# EAGLE design akabeacon_monster (EAGLE 7.2.0)
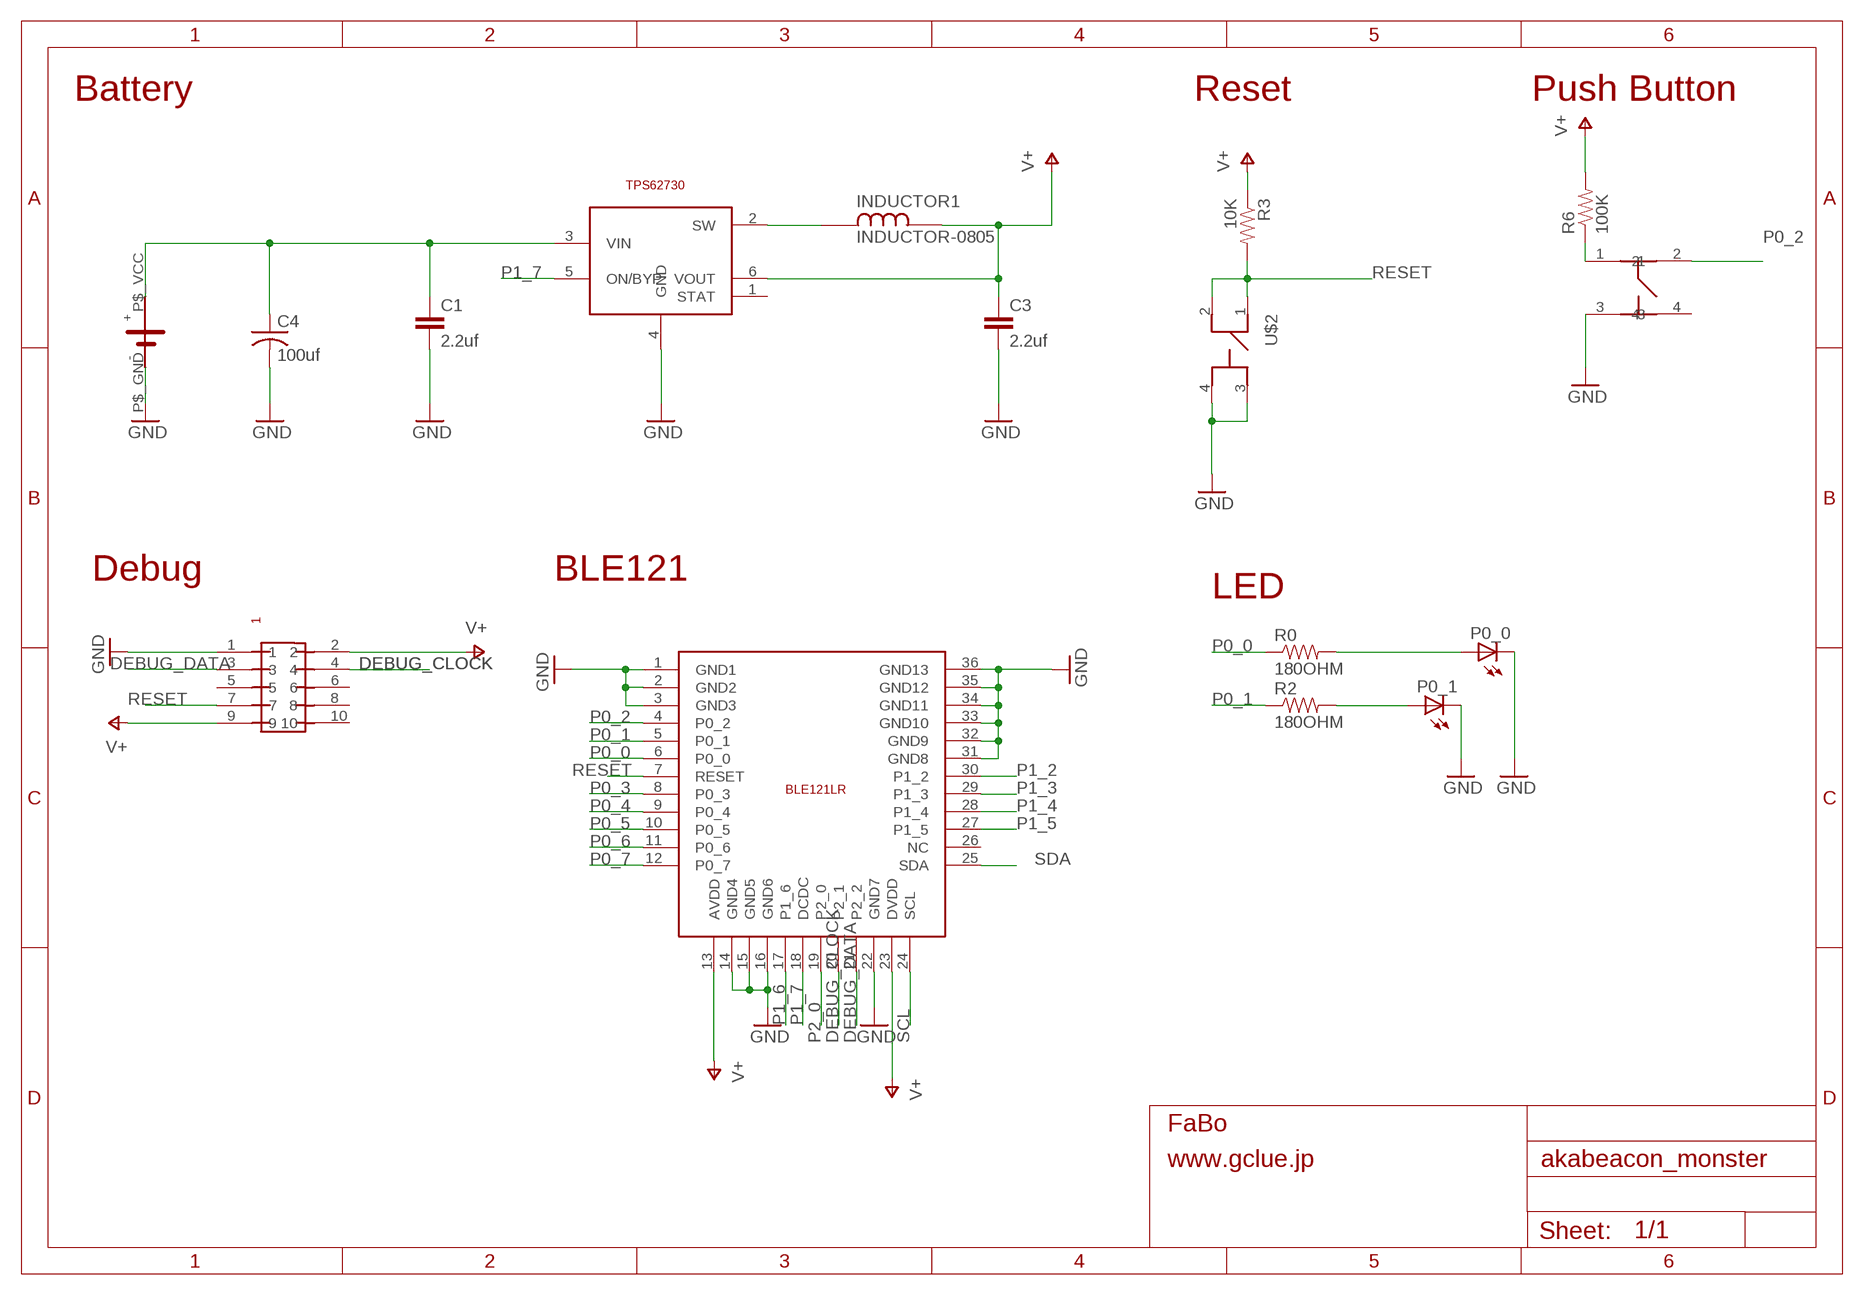
[diagram p0: schematic, sheet 1]

## Parts
BLE1  BLUEGIGA-BLE121LR  [BLUEGIGA-BLE121LR]
C1  2.2uf  C-EUC0603  [C0603]
C3  2.2uf  C-EUC0603  [C0603]
C4  100uf  C-USC3225  [C3225]
INDUCTOR1  INDUCTOR-0805  [INDUCTOR-0805]
P0_0  LEDCHIP-LED0603  [CHIP-LED0603]
P0_1  LEDCHIP-LED0603  [CHIP-LED0603]
R0  180OHM  RESISTOR0603-RES  [0603-RES]
R2  180OHM  RESISTOR0603-RES  [0603-RES]
R3  10K  RESISTOR0603-RES  [0603-RES]
R6  100K  RESISTOR0603-RES  [0603-RES]
TPS1  TI-TPS62730  [TI-TPS62730]
U$1  SMTU2450-BOTTOM-MINI  [SMTU2450-BOTTOM-MINI]
U$2  SWITCH-LS6J2M-T  [SWITCH-LS6J2M-T]
U$3  PIN-HEADER-SMT(1.27MM)2X5  [PIN-HEADER-SMT(1.27MM)2X5]
U$5  SWICTH-4P(KMR2)  [SWITCH-4P(KMR2)]

## Nets
DEBUG_CLOCK: BLE1.20(P2_1) U$3.4
DEBUG_DATA: BLE1.21(P2_2) U$3.3
GND: BLE1.1(GND1) BLE1.2(GND2) BLE1.3(GND3) BLE1.22(GND7) BLE1.31(GND8) BLE1.32(GND9) BLE1.33(GND10) BLE1.34(GND11) BLE1.35(GND12) BLE1.36(GND13) C1.2 C3.2 C4.2 P0_0.C P0_1.C TPS1.4(GND) U$1.P$_GND U$2.3 U$2.4 U$3.1 U$5.3
N$1: C1.1 C4.1 TPS1.3(VIN) U$1.P$_VCC
N$2: P0_0.A R0.2
N$3: P0_1.A R2.2
N$4: U$5.2
N$5: INDUCTOR1.P$1 TPS1.2(SW)
N$8: BLE1.14(GND4) BLE1.15(GND5) BLE1.16(GND6) ; supply symbol labelled GND
P0_0: BLE1.6(P0_0) R0.1
P0_1: BLE1.5(P0_1) R2.1
P0_2: BLE1.4(P0_2) R6.1 U$5.1
P0_3: BLE1.8(P0_3)
P0_4: BLE1.9(P0_4)
P0_5: BLE1.10(P0_5)
P0_6: BLE1.11(P0_6)
P0_7: BLE1.12(P0_7)
P1_2: BLE1.30(P1_2)
P1_3: BLE1.29(P1_3)
P1_4: BLE1.28(P1_4)
P1_5: BLE1.27(P1_5)
P1_6: BLE1.17(P1_6)
P1_7: BLE1.18(DCDC) TPS1.5(ON/BYP)
P2_0: BLE1.19(P2_0)
RESET: BLE1.7(RESET) R3.2 U$2.1 U$2.2 U$3.7
SCL: BLE1.24(SCL)
SDA: BLE1.25(SDA)
V+: BLE1.13(AVDD) BLE1.23(DVDD) C3.1 INDUCTOR1.P$2 R3.1 R6.2 TPS1.6(VOUT) U$3.2 U$3.9
Unconnected: BLE1.26(NC) TPS1.1(STAT) U$3.5 U$3.6 U$3.8 U$3.10 U$5.4

## Notes on the sheet
- Battery | Reset | Push Button
- Debug | BLE121
- LED

## Library data of the parts
BLE1 = gclueBT:BLUEGIGA-BLE121LR: Bluetooth Bluetooth 4.0 low energy radio Radio Transmit power: +8 dBm Receiver sensitivity: -98 dBm Typical line-of-sight range: up to 450 meters Current Consumption TX peak current: 36 mA, 25 mA (with DC/DC) RX peak current: 33 mA Power mode 1: 2.7 mA Power mode 2: 1.3 uA Power mode 3: 0.5 uA Certifications Japan: MIC Japan certification ( 209-J00111 )
C1 C3 = rcl:C-EU: CAPACITOR, European symbol
C4 = rcl:C-US: CAPACITOR, American symbol
INDUCTOR1 = gclueParts:INDUCTOR-0805
P0_0 P0_1 = led:LED: LED OSRAM: - CHIPLED LG R971, LG N971, LY N971, LG Q971, LY Q971, LO R971, LY R971 LH N974, LH R974 LS Q976, LO Q976, LY Q976 LO Q996 - Hyper CHIPLED LW Q18S LB Q993, LB Q99A, LB R99A - SideLED LS A670, LO A670, LY A670, LG A670, LP A670 LB A673, LV A673, LT A673, LW A673 LH A674 LY A675 LS A676, LA A676, LO A676, LY A676, LW A676 LS A679, LY A679, LG A679 - Hyper Micro SIDELED® LS Y876, LA Y876, LO Y876, LY Y876 LT Y87S - SmartLED LW L88C, LW L88S LB L89C, LB L89S, LG L890 LS L89K, LO L89K, LY L89K LS L896, LA L896, LO L896, LY L896 - TOPLED LS T670, LO T670, LY T670, LG T670, LP T670 LSG T670, LSP T670, LSY T670, LOP T670, LYG T670 LG T671, LOG T671, LSG T671 LB T673, LV T673, LT T673, LW T673 LH T674 LS T676, LA T676, LO T676, LY T676, LB T676, LH T676, LSB T676, LW T676 LB T67C, LV T67C, LT T67C, LS T67K, LO T67K, LY T67K, LW E67C LS E67B, LA E67B, LO E67B, LY E67B, LB E67C, LV E67C, LT E67C LW T67C LS T679, LY T679, LG T679 LS T770, LO T770, LY T770, LG T770, LP T770 LB T773, LV T773, LT T773, LW T773 LH T774 LS E675, LA E675, LY E675, LS T675 LS T776, LA T776, LO T776, LY T776, LB T776 LHGB T686 LT T68C, LB T68C - Hyper Mini TOPLED® LB M676 - Mini TOPLED Santana® LG M470 LS M47K, LO M47K, LY M47K Source: http://www.osram.convergy.de LUXEON: - LUMILED® LXK2-PW12-R00, LXK2-PW12-S00, LXK2-PW14-U00, LXK2-PW14-V00 LXK2-PM12-R00, LXK2-PM12-S00, LXK2-PM14-U00 LXK2-PE12-Q00, LXK2-PE12-R00, LXK2-PE12-S00, LXK2-PE14-T00, LXK2-PE14-U00 LXK2-PB12-K00, LXK2-PB12-L00, LXK2-PB12-M00, LXK2-PB14-N00, LXK2-PB14-P00, LXK2-PB14-Q00 LXK2-PR12-L00, LXK2-PR12-M00, LXK2-PR14-Q00, LXK2-PR14-R00 LXK2-PD12-Q00, LXK2-PD12-R00, LXK2-PD12-S00 LXK2-PH12-R00, LXK2-PH12-S00 LXK2-PL12-P00, LXK2-PL12-Q00, LXK2-PL12-R00 Source: www.luxeon.com KINGBRIGHT: KA-3528ASYC Source: www.kingbright.com
R0 R2 R3 R6 = SparkFun:RESISTOR: Resistor Basic schematic elements and footprints for 0603, 1206, and PTH resistors.
TPS1 = gclueSupply:TI-TPS62730
U$1 = gclue:SMTU2450-BOTTOM-MINI
U$2 = gclue:SWITCH-LS6J2M-T: Switch Tact SMD(LS6J2M-T)
U$3 = gclue-test:PIN-HEADER-SMT(1.27MM)2X5: PIN-HEADER-SMT (1.27MM) 2x5
U$5 = gclue-test:SWICTH-4P(KMR2)

## Board
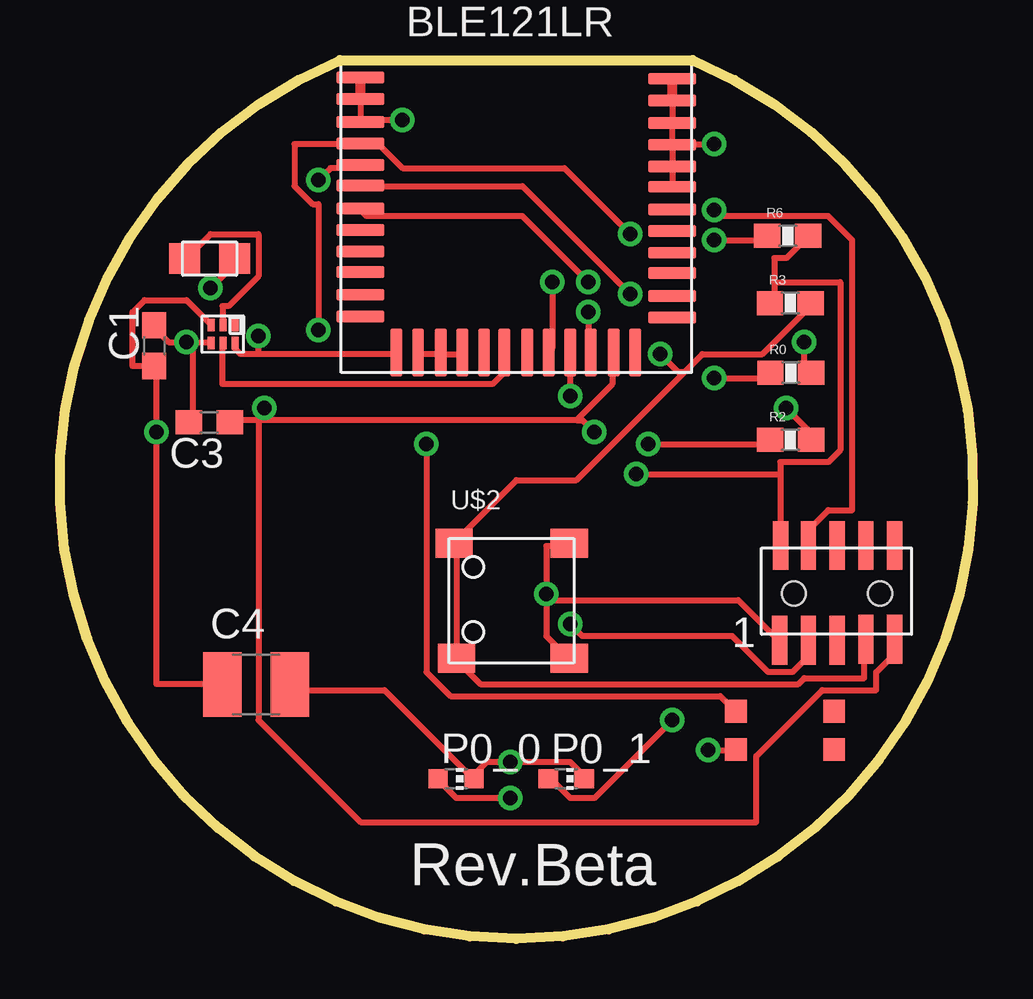
[diagram p1: board, top side]
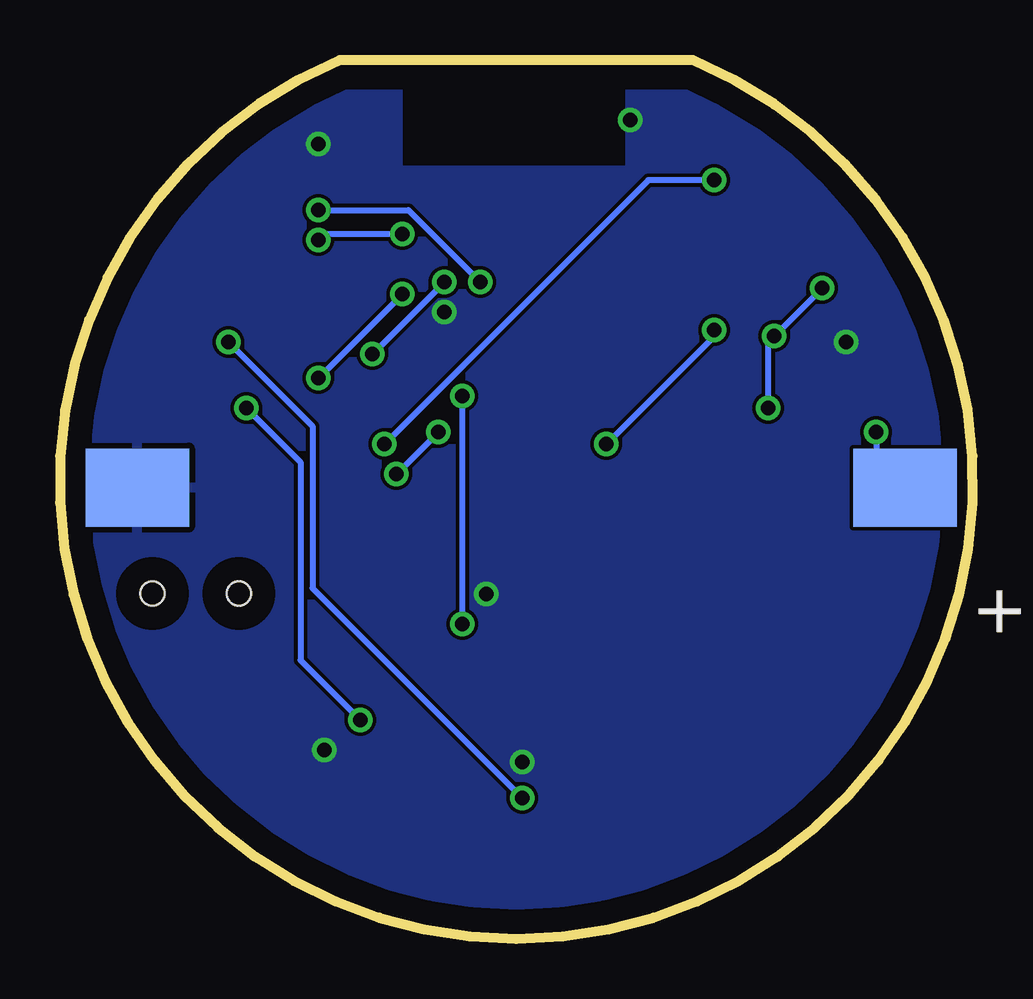
[diagram p2: board, bottom side, seen from below]

Size 38.05 x 36.61 mm. Coordinates in mm from the lower left corner, seen from the top.
Outline: 26.38,36.61 arc-315 11.68,36.61 26.38,36.61
Copper layers (1*16): Top 0.035mm / dielectric 1.5mm / Bottom 0.035mm
Design rules "default *": minimum track width 10mil, minimum drill 24mil, track to track 6mil, track to pad 6mil, pad to pad 6mil, via to via 6mil, smd to smd 6mil, copper to edge 40mil, drill to drill 8mil, minimum pad ring 10mil, minimum via ring 8mil, stop-mask expansion 4mil, vias tented up to drill 0mil, thermal gap 10mil
tRestrict: area 15,32.4 to 23.5,38.6
bRestrict: area 15,32.4 to 23.5,38.7

### Footprints (pad centres in the part's own frame; a part is rotated, then mirrored left to right if it is on the bottom)
BLUEGIGA-BLE121LR = smd 2 x 0.5: 1 -6.4,4.8; 2 -6.4,3.9; 3 -6.4,2.95; 4 -6.4,2.05; 5 -6.4,1.15; 6 -6.4,0.3; 7 -6.4,-0.65; 8 -6.4,-1.55; 9 -6.4,-2.45; 10 -6.4,-3.3; 11 -6.4,-4.25; 12 -6.4,-5.15; 25 6.6,-5.2; 26 6.6,-4.3; 27 6.6,-3.35; 28 6.6,-2.5; 29 6.6,-1.6; 30 6.6,-0.7; 31 6.6,0.25; 32 6.6,1.1; 33 6.6,2; 34 6.6,2.9; 35 6.6,3.85; 36 6.6,4.75 | smd 0.5 x 2: 13 -4.9,-6.65; 14 -4,-6.65; 15 -3.05,-6.65; 16 -2.15,-6.65; 17 -1.25,-6.65; 18 -0.4,-6.65; 19 0.55,-6.65; 20 1.45,-6.65; 21 2.35,-6.65; 22 3.2,-6.65; 23 4.15,-6.65; 24 5.05,-6.65
C0603 = smd 1.1 x 1: 1 -0.85,0; 2 0.85,0
C3225 = smd 1.6 x 2.7: 1 -1.4,0; 2 1.4,0
INDUCTOR-0805 = smd 1.3 x 1.27: P$1 -1.04,0.02; P$2 1.04,0.01
CHIP-LED0603 = smd 0.8 x 0.8: A 0,-0.75; C 0,0.75
0603-RES = smd 1.1 x 1: 1 -0.85,0; 2 0.85,0
TI-TPS62730 = smd 0.3 x 0.52: 1 0.48,0.25; 2 -0.02,0.25; 3 -0.52,0.25; 4 -0.52,-0.5; 5 -0.02,-0.5; 6 0.48,-0.5
SMTU2450-BOTTOM-MINI = smd 3.251 x 4.318 bottom: P$_GND 0,-16; P$_VCC 0,16
SWITCH-LS6J2M-T = smd 1.55 x 1.2: 1 -2.4,2.4; 2 -2.3,-2.4; 3 2.4,2.4; 4 2.4,-2.4
PIN-HEADER-SMT(1.27MM)2X5 = smd 0.635 x 2.032: 1 -2.8,-1.65; 2 -2.75,2.3; 3 -1.6,-1.65; 4 -1.6,2.3; 5 -0.4,-1.65; 6 -0.4,2.3; 7 0.8,-1.6; 8 0.8,2.3; 9 2,-1.6; 10 2,2.3 | hole 1: 1.4,0.3; -2.2,0.3
SWITCH-4P(KMR2) = smd 0.9 x 0.95: 1 -1,0; 2 3.1,0; 3 -1,-1.6; 4 3.1,-1.6

### Placement (x,y rotation side)
BLE1  18.93,31.08 0 top
C1  3.94,24.71 90 top
C3  6.23,21.51 180 top
C4  8.18,10.59 0 top
INDUCTOR1  6.24,28.32 0 top
P0_0  16.52,6.66 270 top
P0_1  21.11,6.66 270 top
R0  30.47,23.58 0 top
R2  30.46,20.78 0 top
R3  30.45,26.48 0 top
R6  30.34,29.28 0 top
TPS1  6.83,25.32 0 top
U$1  18.83,18.79 90 top
U$2  18.83,14.08 0 top
U$3  32.8,14.08 0 top
U$5  29.18,9.48 0 top

### Tracks (layer width: path | path; a pad name or v marks a point on that pad's centre or on a via)
DEBUG_CLOCK  (via drill 0.61)
  Top 0.254: v20.53,27.36 20.53,24.61 BLE1.20 | v27.28,30.36 27.53,30.11 32.03,30.11 33.03,29.11 33.03,17.86 32.03,17.86 31.28,17.11 31.28,16.61 U$3.4
  Bottom 0.254: v20.53,27.36 23.53,30.36 v27.28,30.36
DEBUG_DATA  (via drill 0.61)
  Top 0.254: v21.28,22.61 BLE1.21 | v21.28,13.11 21.78,12.61 28.03,12.61 29.53,11.11 30.53,11.11 31.03,11.61 31.03,12.36 U$3.3
  Bottom 0.254: v21.28,13.11 v21.28,22.61
GND  (via drill 0.61)
  Top 0.254: P0_1.C 21.78,6.86 21.28,7.36 v18.78,7.36 17.78,7.36 17.28,6.86 P0_0.C 17.03,6.86 13.53,10.36 9.78,10.36 C4.2 | 20.28,14.11 v20.28,14.36 20.28,16.36 21.03,16.36 U$2.3 | 20.28,14.11 20.28,12.61 21.03,11.86 U$2.4 | 20.28,14.11 28.28,14.11 29.78,12.61 U$3.1 | 5.53,24.86 v5.28,24.86 4.53,24.86 4.03,25.36 C1.2 | 5.53,24.86 6.28,24.86 TPS1.4 | 5.53,24.86 5.53,21.61 C3.2 | BLE1.2 12.53,34.11 | BLE1.35 BLE1.34 25.53,33.11 | BLE1.31 BLE1.32 BLE1.33 25.53,33.11 | v27.03,7.86 28.03,7.86 U$5.3 | 25.53,33.11 v27.28,33.11 | v22.03,26.11 22.03,24.61 BLE1.22 | v14.28,34.11 12.53,34.11 | 12.53,34.11 BLE1.3
  Top 0.406: BLE1.2 BLE1.1 | BLE1.35 BLE1.36
  pour Bottom: -1.52,0.01 38.28,0.01 38.28,38.31 23.98,38.31 23.98,32.01 14.28,32.01 14.28,38.51 -1.82,38.51
N$1  (via drill 0.61)
  Top 0.254: TPS1.3 6.28,25.61 5.28,26.61 3.53,26.61 3.03,26.11 3.03,23.86 C1.1 4.03,23.86 v4.03,21.11 4.03,10.61 6.78,10.61 C4.1
  Bottom 0.254: v4.03,21.11 4.03,19.86 3.03,18.86 U$1.P$_VCC
N$2  (via drill 0.61)
  Top 0.254: v18.78,5.86 16.53,5.86 15.78,6.61 P0_0.A | v31.03,24.86 31.03,23.61 31.28,23.61 R0.2
  Bottom 0.254: v18.78,5.86 27.53,14.61 27.53,21.36 v31.03,24.86
N$3  (via drill 0.61)
  Top 0.254: v25.53,9.11 22.28,5.86 21.28,5.86 20.53,6.61 P0_1.A | v30.28,22.11 31.53,20.86 R2.2
  Bottom 0.254: v25.53,9.11 28.03,11.61 28.03,19.86 v30.28,22.11
N$5
  Top 0.254: TPS1.2 6.78,25.61 6.78,26.36 7.03,26.36 8.28,27.61 8.28,29.36 6.28,29.36 5.28,28.36 INDUCTOR1.P$1
N$8
  Top 0.254: BLE1.14 15.03,24.36 15.78,24.36 BLE1.15 16.03,24.36 16.78,24.36 BLE1.16
P0_0  (via drill 0.61)
  Top 0.254: v27.28,23.36 29.53,23.36 R0.1 | v23.78,26.86 19.28,31.36 12.53,31.36 BLE1.6
  Bottom 0.254: v23.78,26.86 v27.28,23.36
P0_1  (via drill 0.61)
  Top 0.254: v24.53,20.61 29.53,20.61 R2.1 | v10.78,31.61 11.28,32.11 12.53,32.11 BLE1.5
  Bottom 0.254: v24.53,20.61 13.53,31.61 v10.78,31.61
P0_2  (via drill 0.61)
  Top 0.254: v15.28,20.61 15.28,11.11 16.28,10.11 27.53,10.11 28.03,9.61 U$5.1 | v10.78,25.36 10.78,30.61 10.53,30.61 9.78,31.36 9.78,33.11 12.53,33.11 | v27.28,29.11 29.28,29.11 R6.1 | v23.78,29.36 21.03,32.11 14.28,32.11 13.28,33.11 12.53,33.11 | 12.53,33.11 BLE1.4
  Bottom 0.254: v15.28,20.61 10.78,25.11 v10.78,25.36 | v27.28,29.11 27.03,29.36 v23.78,29.36
P1_7
  Top 0.254: BLE1.18 18.53,23.61 18.03,23.11 6.78,23.11 6.78,24.61 TPS1.5
RESET  (via drill 0.61)
  Top 0.254: 26.03,23.61 21.53,19.11 19.03,19.11 16.53,16.61 U$2.1 16.53,16.36 U$2.2 16.53,11.61 17.53,10.61 30.78,10.61 31.03,10.86 33.53,10.86 33.53,12.36 U$3.7 | 26.03,23.61 26.78,24.36 29.28,24.36 31.28,26.36 R3.2 | v22.03,27.36 19.28,30.11 12.78,30.11 12.53,30.36 BLE1.7 | v25.03,24.36 25.78,23.61 26.03,23.61
  Bottom 0.254: v25.03,24.36 v22.03,27.36
V+  (via drill 0.61)
  Top 0.254: 29.78,27.36 29.78,28.36 30.28,28.36 31.03,29.11 R6.2 | 29.78,27.36 29.78,26.61 R3.1 | 30.03,19.36 30.03,19.86 32.03,19.86 32.53,20.36 32.53,27.36 29.78,27.36 | 30.03,19.36 30.03,16.61 U$3.2 | 8.28,24.36 14.03,24.36 BLE1.13 | 8.28,24.36 7.53,24.36 7.28,24.61 TPS1.6 | v6.28,27.11 7.28,28.11 INDUCTOR1.P$2 | 8.28,24.36 v8.28,25.11 | 21.53,21.61 8.53,21.61 | 8.53,21.61 8.28,21.61 | 8.28,21.61 7.28,21.61 C3.1 | 21.53,21.61 23.03,23.11 23.03,24.36 BLE1.23 | 8.28,21.61 8.28,9.11 12.53,4.86 29.03,4.86 29.03,7.61 31.78,10.36 34.03,10.36 34.03,11.11 34.78,11.86 34.78,12.36 U$3.9 | 8.53,21.61 v8.53,22.11 | v24.03,19.36 30.03,19.36 | v22.28,21.11 21.78,21.61 21.53,21.61
  Bottom 0.254: v6.28,27.11 v8.28,25.11 8.53,24.86 v8.53,22.11 | v22.28,21.11 v24.03,19.36

### Text on the board
tPlace: Rev.Beta